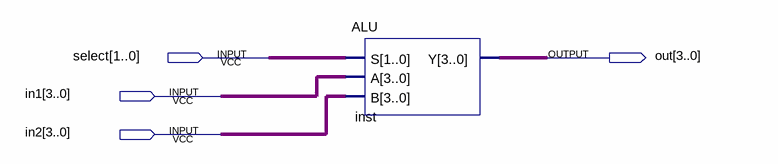
[diagram p0: schematic sheet]
// Quartus schematic Ass1 2.bdf as structural Verilog: 1 symbols, 4 pins
module \Ass1_2  (
  input  [1:0] select,
  input  [3:0] in1,
  input  [3:0] in2,
  output [3:0] out
);

  ALU inst (.S(select), .A(in1), .B(in2), .Y(out));
endmodule
